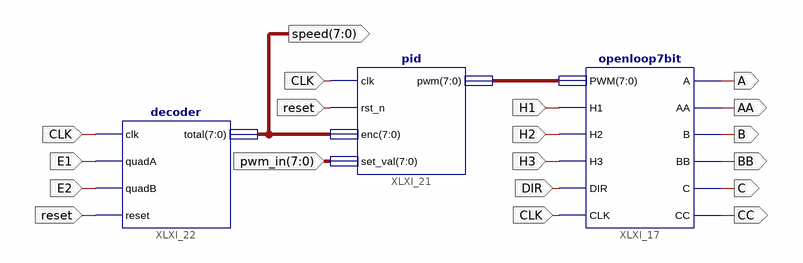
[diagram p0: schematic sheet 1]
// Xilinx ISE schematic closed_loop.sch (spartan6) as structural Verilog: 3 symbols, 16 ports
module closed_loop (
  input  [7:0] pwm_in,
  input  CLK,
  input  reset,
  input  DIR,
  input  H3,
  input  H2,
  input  H1,
  input  E2,
  input  E1,
  output CC,
  output C,
  output BB,
  output B,
  output AA,
  output A,
  output [7:0] speed
);

  wire [7:0] XLXN_143;

  openloop7bit XLXI_17 (
    .PWM(XLXN_143), .H1(H1), .H2(H2), .H3(H3), .DIR(DIR), .CLK(CLK), .A(A), .AA(AA), .B(B), .BB(BB), .C(C),
    .CC(CC));
  pid XLXI_21 (.clk(CLK), .rst_n(reset), .enc(speed), .set_val(pwm_in), .pwm(XLXN_143));
  decoder XLXI_22 (.clk(CLK), .quadA(E1), .quadB(E2), .reset(reset), .total(speed));
endmodule
